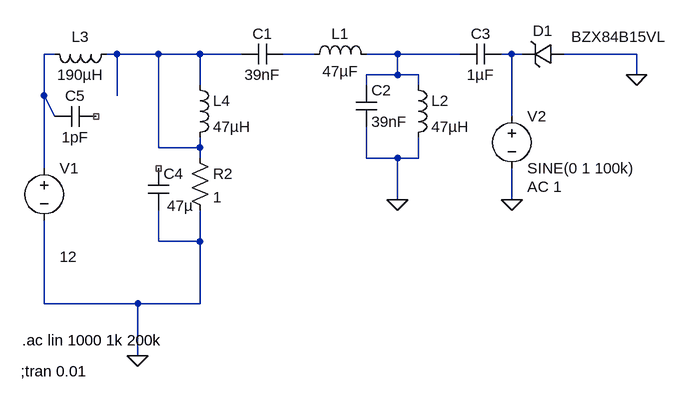
[diagram p0: schematic TDA_Filter.asc]
TDA_Filter.asc, the LTspice schematic file:
Version 4
SHEET 1 1532 1044
WIRE 96 -32 80 -32
WIRE 192 -32 176 -32
WIRE 256 -32 192 -32
WIRE 320 -32 256 -32
WIRE 384 -32 320 -32
WIRE 496 -32 448 -32
WIRE 624 -32 576 -32
WIRE 720 -32 624 -32
WIRE 800 -32 784 -32
WIRE 816 -32 800 -32
WIRE 992 -32 880 -32
WIRE 624 0 624 -32
WIRE 624 0 576 0
WIRE 656 0 624 0
WIRE 992 0 992 -32
WIRE 320 16 320 -32
WIRE 576 16 576 0
WIRE 656 16 656 0
WIRE 80 32 80 -32
WIRE 192 32 192 -32
WIRE 96 64 80 32
WIRE 800 64 800 -32
WIRE 256 112 256 -32
WIRE 320 112 320 96
WIRE 320 112 256 112
WIRE 320 128 320 112
WIRE 576 128 576 80
WIRE 624 128 576 128
WIRE 656 128 656 96
WIRE 656 128 624 128
WIRE 80 144 80 32
WIRE 624 192 624 128
WIRE 800 192 800 144
WIRE 256 256 256 208
WIRE 320 256 320 208
WIRE 320 256 256 256
WIRE 80 352 80 224
WIRE 224 352 80 352
WIRE 320 352 320 256
WIRE 320 352 224 352
WIRE 224 432 224 352
FLAG 224 432 0
FLAG 624 192 0
FLAG 800 192 0
FLAG 992 0 0
SYMBOL voltage 80 128 R0
WINDOW 3 24 152 Left 2
WINDOW 123 24 124 Left 2
WINDOW 39 0 0 Left 0
SYMATTR InstName V1
SYMATTR Value 12
SYMBOL res 304 112 R0
SYMATTR InstName R2
SYMATTR Value 1
SYMBOL cap 448 -48 R90
WINDOW 0 0 32 VBottom 2
WINDOW 3 32 32 VTop 2
SYMATTR InstName C1
SYMATTR Value 39nF
SYMBOL ind 480 -16 R270
WINDOW 0 32 56 VTop 2
WINDOW 3 5 56 VBottom 2
SYMATTR InstName L1
SYMATTR Value 47µF
SYMBOL cap 560 16 R0
SYMATTR InstName C2
SYMATTR Value 39nF
SYMBOL ind 640 0 R0
SYMATTR InstName L2
SYMATTR Value 47µH
SYMBOL cap 784 -48 R90
WINDOW 0 0 32 VBottom 2
WINDOW 3 32 32 VTop 2
SYMATTR InstName C3
SYMATTR Value 1µF
SYMBOL voltage 800 48 R0
WINDOW 123 24 124 Left 2
WINDOW 39 0 0 Left 0
SYMATTR InstName V2
SYMATTR Value SINE(0 1 100k)
SYMATTR Value2 AC 1
SYMBOL zener 880 -48 R90
WINDOW 0 -4 32 VBottom 2
WINDOW 3 -26 -84 VTop 2
SYMATTR InstName D1
SYMATTR Value BZX84B15VL
SYMBOL ind 192 -48 R90
WINDOW 0 5 56 VBottom 2
WINDOW 3 32 56 VTop 2
SYMATTR InstName L3
SYMATTR Value 190µH
SYMBOL ind 304 0 R0
SYMATTR InstName L4
SYMATTR Value 47µH
SYMBOL cap 240 144 R0
WINDOW 3 29 57 Left 2
SYMATTR InstName C4
SYMATTR Value 47µ
SYMBOL cap 160 48 R90
WINDOW 0 0 32 VBottom 2
WINDOW 3 32 32 VTop 2
SYMATTR InstName C5
SYMATTR Value 1pF
TEXT 46 408 Left 2 !.ac lin 1000 1k 200k
TEXT 44 456 Left 2 !;tran 0.01

The netlist it stands for:
* TDA_Filter.asc
V1 N001 0 12
R2 N002 0 1
C1 N003 N002 39nF
L1 N003 N004 47µF
C2 N004 0 39nF
L2 N004 0 47µH
C3 N005 N004 1µF
V2 N005 0 SINE(0 1 100k) AC 1
D1 0 N005 BZX84B15VL
L3 N002 N001 190µH
L4 N002 N002 47µH
C4 NC_01 0 47µ
C5 NC_02 N001 1pF
.model D D
.lib standard.dio
.ac lin 1000 1k 200k
;tran 0.01
.backanno
.end